# Altium schematic sheet 11.SchDoc
size 513 x 386 mm
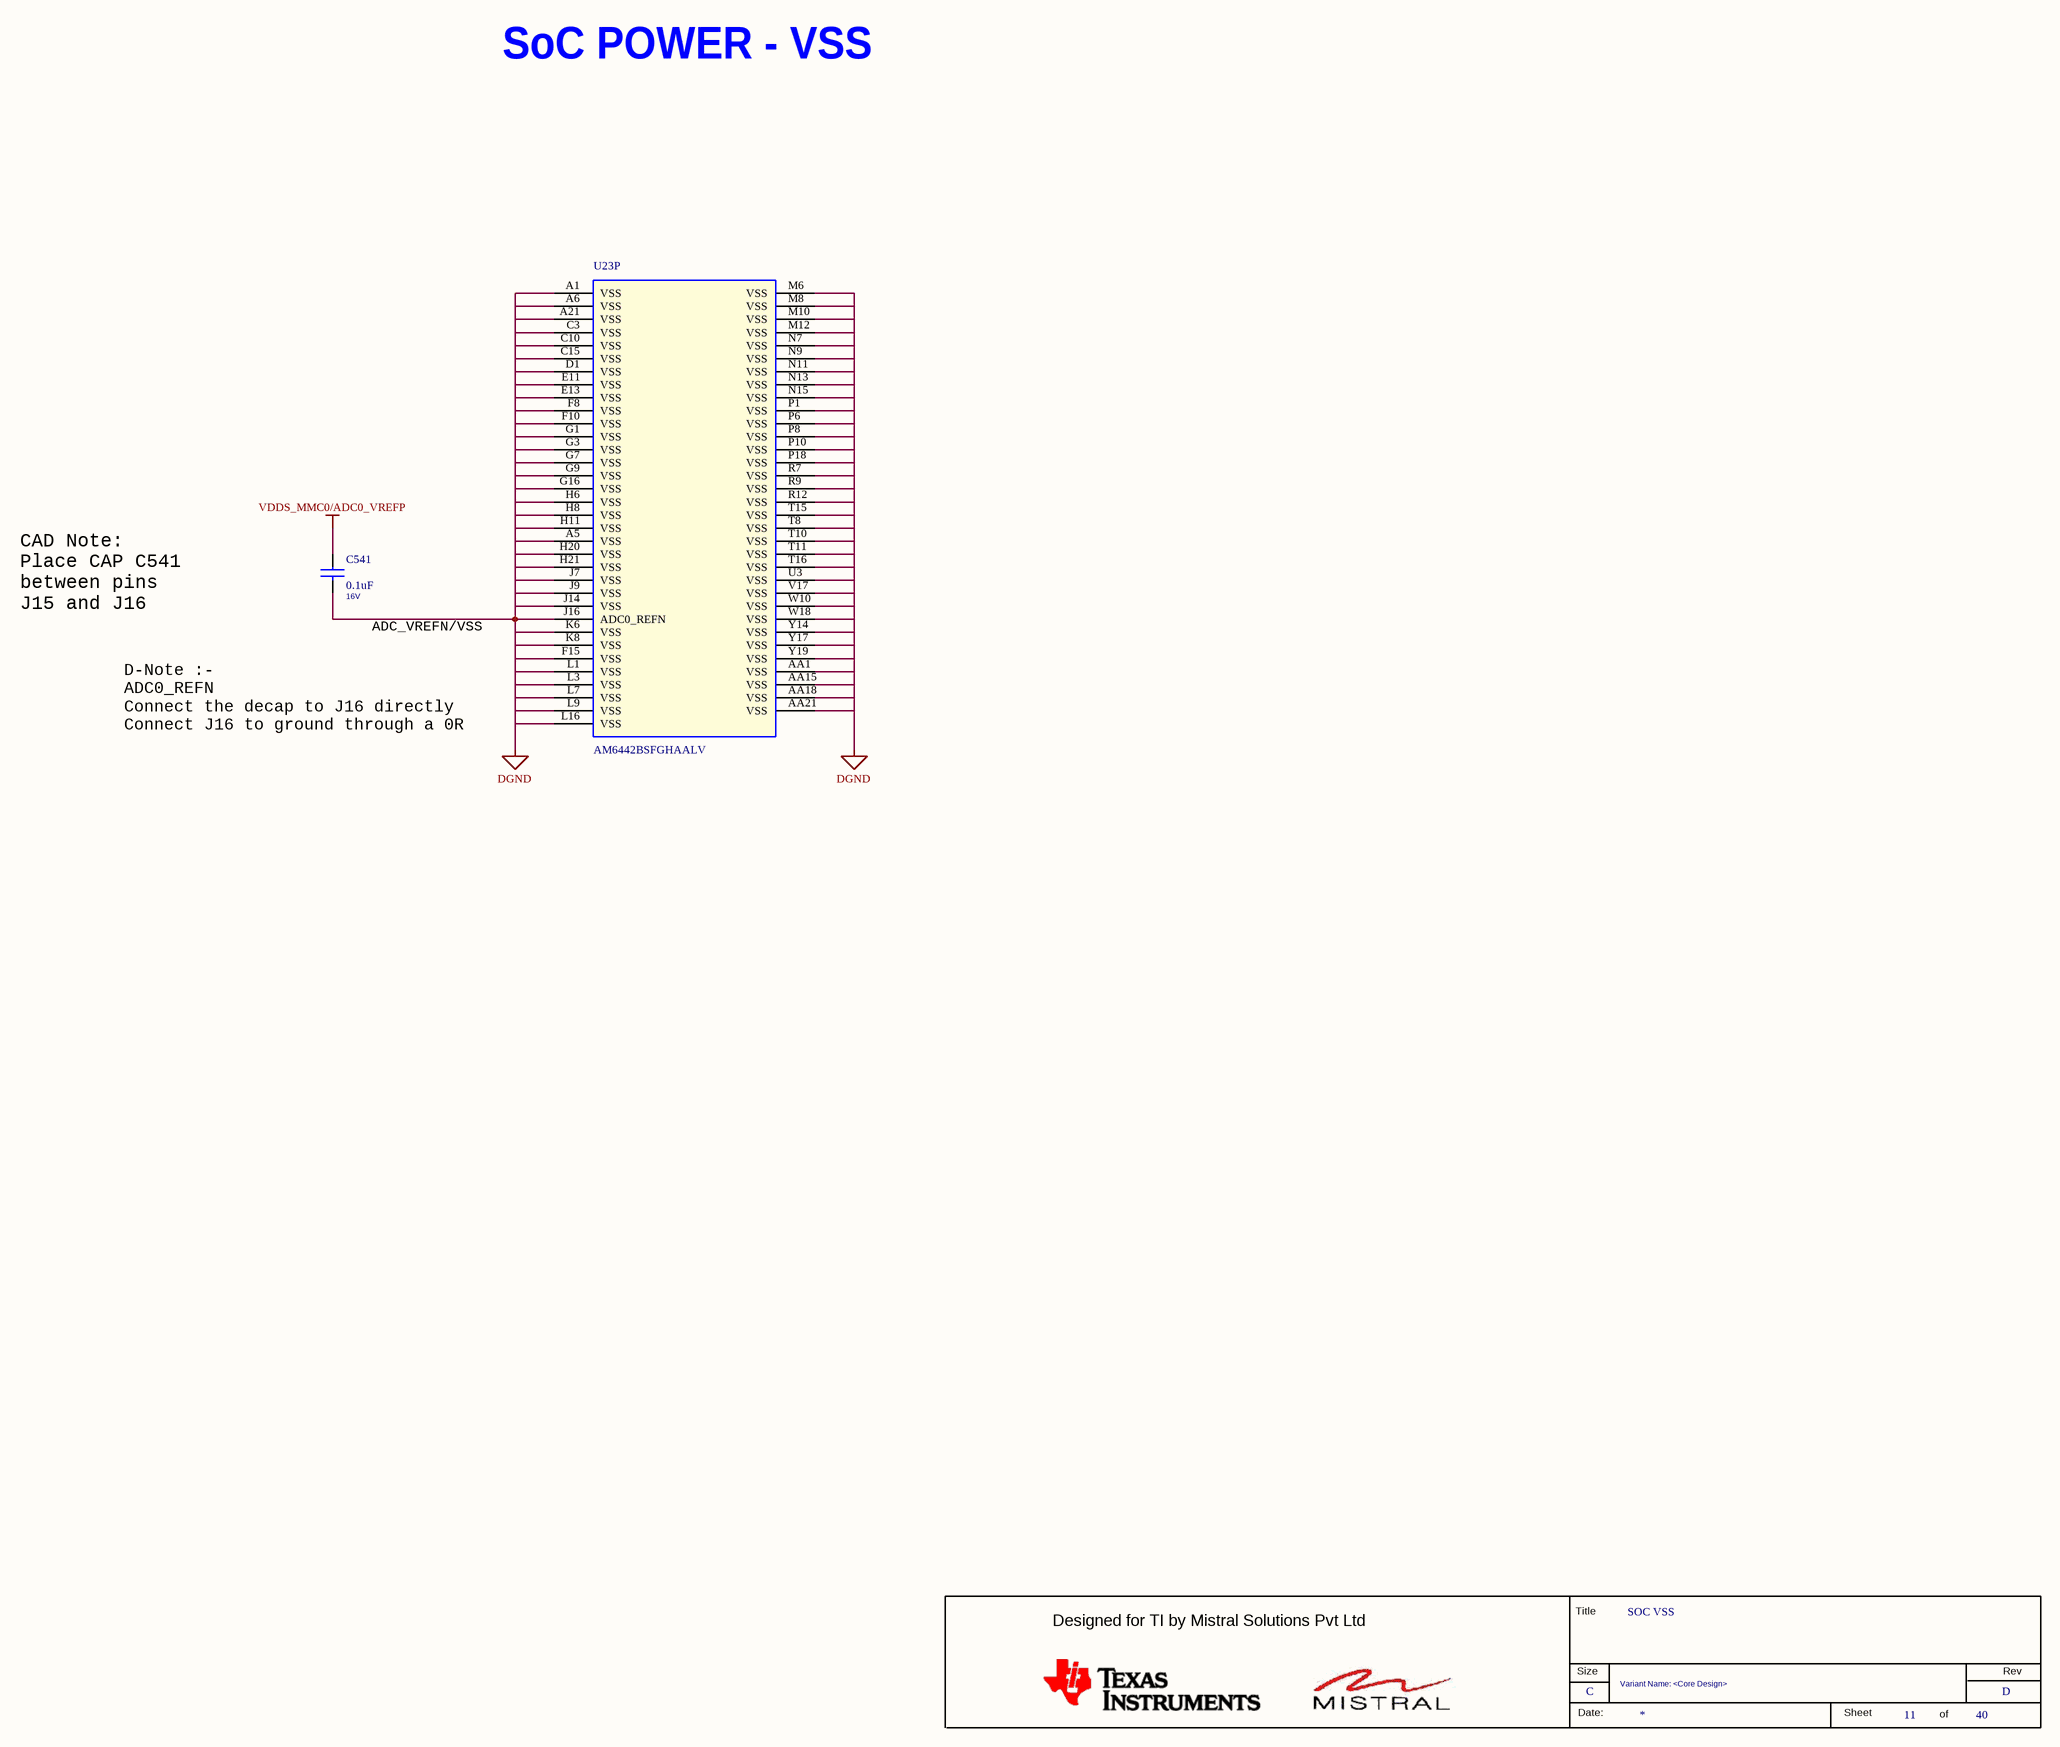
[diagram p0: 11.SchDoc]

## Parts
*  RevCode: D  Title: SOC VSS  Page Size: C  Page Number: 11  Page Count: 40  Variant Name: <Core Design>  (hidden comment: MISTRAL_TITLEBLK_CSIZE)  (graphical)
C541  0.1uF  Voltage: 16V  [CAP0201_0-5]
U23  AM6442BSFGHAALV  [FCBGA441_31-49_680X680_2-6]  (part P of 16)

## Nets
DGND: C541.2 U23.A1(VSS) U23.A5(VSS) U23.A6(VSS) U23.A21(VSS) U23.AA1(VSS) U23.AA15(VSS) U23.AA18(VSS) U23.AA21(VSS) U23.C3(VSS) U23.C10(VSS) U23.C15(VSS) U23.D1(VSS) U23.E11(VSS) U23.E13(VSS) U23.F8(VSS) U23.F10(VSS) U23.F15(VSS) U23.G1(VSS) U23.G3(VSS) U23.G7(VSS) U23.G9(VSS) U23.G16(VSS) U23.H6(VSS) U23.H8(VSS) U23.H11(VSS) U23.H20(VSS) U23.H21(VSS) U23.J7(VSS) U23.J9(VSS) U23.J14(VSS) U23.J16(ADC0_REFN) U23.K6(VSS) U23.K8(VSS) U23.L1(VSS) U23.L3(VSS) U23.L7(VSS) U23.L9(VSS) U23.L16(VSS) U23.M6(VSS) U23.M8(VSS) U23.M10(VSS) U23.M12(VSS) U23.N7(VSS) U23.N9(VSS) U23.N11(VSS) U23.N13(VSS) U23.N15(VSS) U23.P1(VSS) U23.P6(VSS) U23.P8(VSS) U23.P10(VSS) U23.P18(VSS) U23.R7(VSS) U23.R9(VSS) U23.R12(VSS) U23.T8(VSS) U23.T10(VSS) U23.T11(VSS) U23.T15(VSS) U23.T16(VSS) U23.U3(VSS) U23.V17(VSS) U23.W10(VSS) U23.W18(VSS) U23.Y14(VSS) U23.Y17(VSS) U23.Y19(VSS)
VDDS_MMC0/ADC0_VREFP: C541.1

## Notes on the sheet
- SoC POWER - VSS
- CAD Note:
  Place CAP C541
  between pins
  J15 and J16
- D-Note :-
  ADC0_REFN
  Connect the decap to J16 directly
  Connect J16 to ground through a 0R
- ADC_VREFN/VSS
- (in symbol MISTRAL_TITLEBLK_CSIZE) Title; Designed for TI by Mistral Solutions Pvt Ltd; Size; Rev; Date:; Sheet; of

## Library data of the parts
* = MISTRAL_TITLEBLK_CSIZE: Issue: 1.0; Page Create Date: March  8, 1995; Page Modify Date: *
C541 = CAP_Dup3: CAP CERAMIC 0.1uF 16V 10% X5R 0201; Mistral Part No: 120009030072-R; Mfr_name: MURATA; Mfr_part_number: GRM033R61C104KE84J; Part_type: CAPACITORS\CERAMIC; Project: TI_MAXIE_CPB; Wattage: NA; Customs_HS_Code: 85322990; Custom_Duty: 15%; Footprint Path: Y:\MIS_DATABASE\Library\ALTIUM_TOOL\PCB_FOOTPRINTS\Altium_Footprint_Lib.PcbLib; Library Path: Y:\MIS_DATABASE\Library\ALTIUM_TOOL\SCHEMATICS_PARTS\MS_DISCRETE_Library.schlib; Footprint Ref: CAP0201_0-5; Library Ref: CAP; Tolerance: 10%; Package: 0201; Distributor_name: DIGIKEY; Distributor_part_number: 490-16742-1-ND; Height: 0.33MM; Weight: 0.33mg; Temperature: -55癈+85癈; Datasheet: Y:\MIS_DATABASE\DATASHEETS\CAPACITORS\GRM033R61C104KE84.PDF; Crtd /date: MANIRAJA/120218; Chkd/date: MANIRAJA/120218; MECHANICAL 3D STEP FILE: CAP0201_0-5; PCB Footprint: CAP0201_0-5
U23 = XAM6442BSFGGAALV_BGA441: IC AM64x SoC MICROPROCESSOR BGA441; Mistral Part No: 141220080002; Mfr_name: TEXAS INSTRUMENTS; Part_type: ICS\DIGITAL\MICROPROCESSOR; Project: AM64x-GP_EVM BRD; Tolerance: NA; Customs_HS_Code: 85423100; Custom_Duty: 15%; PCB Footprint: FCBGA441_31-49_680X680_2-6; Footprint Ref: FCBGA441_31-49_680X680_2-6; Mfr_part_number: AM6442BSFGHAALV; Voltage: NA; Wattage: NA; Package: BGA441; Distributor_name: NA; Distributor_part_number: NA; Library Ref: XAM6442BSFGGAALV_BGA441; Height: 2.57MM; Weight: NA; Temperature: NA; Datasheet: Y:\MIS_DATABASE\DATASHEETS\ICS\DIGITAL\MICROCONTROLLER\AM64-SoC_SVB.PDF; Crtd /date: ALVY/300322; Chkd/date: ALVY/300322; RoHS: NA; MECHANICAL 3D STEP FILE: FCBGA441_31-49_680X680_2-6; Library Path: Y:\MIS_DATABASE\Library\ALTIUM_TOOL\SCHEMATICS_PARTS\MS_MICROPROCESSOR_Library.schlib; Footprint Path: Y:\MIS_DATABASE\Library\ALTIUM_TOOL\PCB_FOOTPRINTS\Altium_Footprint_Lib.PcbLib